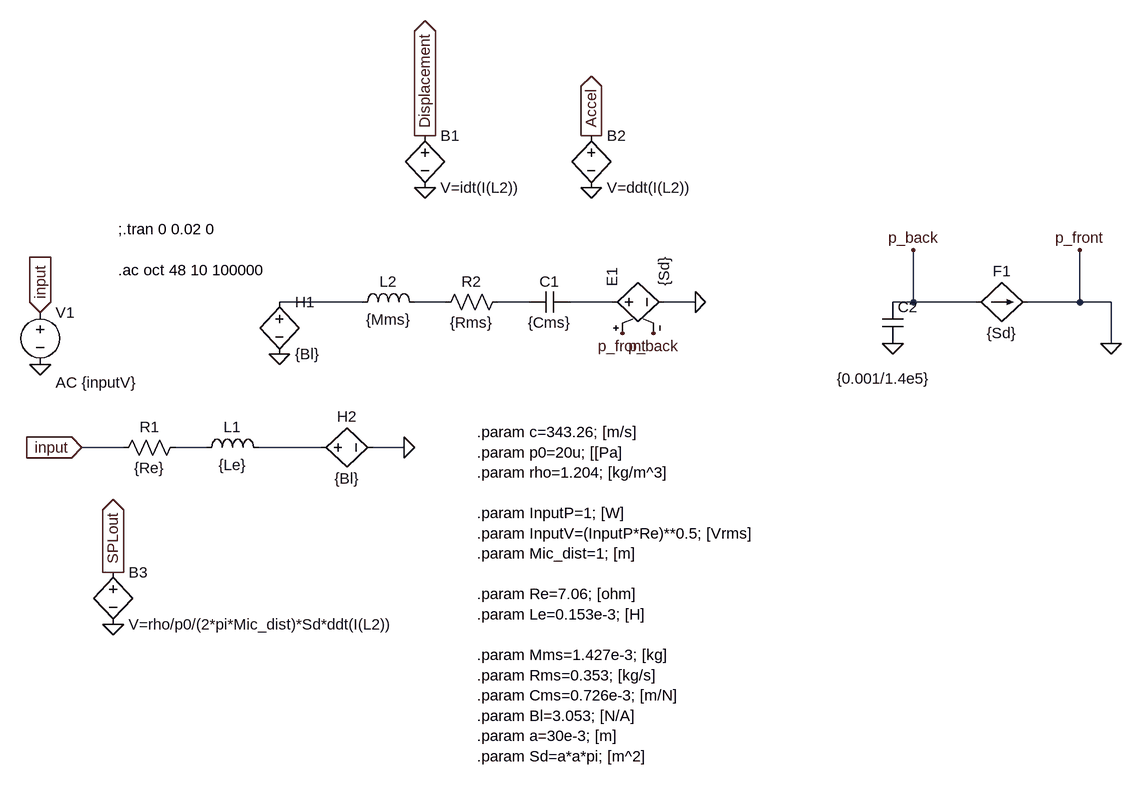
[diagram p0: schematic demo_05.asc]
demo_05.asc, the LTspice schematic file:
Version 4
SHEET 1 1700 776
WIRE 528 112 400 112
WIRE 656 112 608 112
WIRE 784 112 736 112
WIRE 912 112 848 112
WIRE 1040 112 992 112
WIRE 1376 112 1376 32
WIRE 1376 112 1344 112
WIRE 1472 112 1376 112
WIRE 1632 112 1632 32
WIRE 1632 112 1552 112
WIRE 1680 112 1632 112
WIRE 1680 176 1680 112
WIRE 160 336 96 336
WIRE 288 336 240 336
WIRE 464 336 368 336
WIRE 592 336 544 336
FLAG 32 208 0
FLAG 32 128 input
IOPIN 32 128 In
FLAG 592 336 0
FLAG 96 336 input
IOPIN 96 336 In
FLAG 1040 112 0
FLAG 624 -64 0
FLAG 880 -64 0
FLAG 624 -144 Displacement
IOPIN 624 -144 Out
FLAG 880 -144 Accel
IOPIN 880 -144 Out
FLAG 400 192 0
FLAG 144 608 0
FLAG 144 528 SPLout
IOPIN 144 528 Out
FLAG 1344 176 0
FLAG 1680 176 0
FLAG 1376 32 p_back
FLAG 1632 32 p_front
FLAG 976 160 p_back
FLAG 928 160 p_front
SYMBOL voltage 32 112 R0
WINDOW 123 24 124 Left 2
WINDOW 39 0 0 Left 0
SYMATTR Value2 AC {inputV}
SYMATTR InstName V1
SYMATTR Value ""
SYMBOL res 144 352 R270
WINDOW 0 32 56 VTop 2
WINDOW 3 0 56 VBottom 2
SYMATTR InstName R1
SYMATTR Value {Re}
SYMBOL ind 272 352 R270
WINDOW 0 32 56 VTop 2
WINDOW 3 5 56 VBottom 2
SYMATTR InstName L1
SYMATTR Value {Le}
SYMBOL ind 512 128 R270
WINDOW 0 32 56 VTop 2
WINDOW 3 5 56 VBottom 2
SYMATTR InstName L2
SYMATTR Value {Mms}
SYMBOL res 640 128 R270
WINDOW 0 32 56 VTop 2
WINDOW 3 0 56 VBottom 2
SYMATTR InstName R2
SYMATTR Value {Rms}
SYMBOL cap 784 128 R270
WINDOW 0 32 32 VTop 2
WINDOW 3 0 32 VBottom 2
SYMATTR InstName C1
SYMATTR Value {Cms}
SYMBOL bv 624 -160 R0
SYMATTR InstName B1
SYMATTR Value V=idt(I(L2))
SYMBOL bv 880 -160 R0
SYMATTR InstName B2
SYMATTR Value V=ddt(I(L2))
SYMBOL h 400 96 R0
SYMATTR InstName H1
SYMATTR Value {Bl}
SYMATTR SpiceModel L1
SYMBOL h 448 336 R270
WINDOW 0 32 56 VTop 2
WINDOW 3 -32 56 VBottom 2
SYMATTR InstName H2
SYMATTR Value {Bl}
SYMATTR SpiceModel L2
SYMBOL bv 144 512 R0
SYMATTR InstName B3
SYMATTR Value V=rho/p0/(2*pi*Mic_dist)*Sd*ddt(I(L2))
SYMBOL f 1472 112 R270
WINDOW 0 32 40 VTop 2
WINDOW 3 -32 40 VBottom 2
SYMATTR InstName F1
SYMATTR Value {Sd}
SYMATTR SpiceModel L2
SYMBOL cap 1328 112 R0
WINDOW 3 -70 118 Left 2
SYMATTR InstName C2
SYMATTR Value {0.001/1.4e5}
SYMATTR SpiceLine Rpar=1e999
SYMBOL e 896 112 R270
SYMATTR InstName E1
SYMATTR Value {Sd}
TEXT 152 0 Left 2 !;.tran 0 0.02 0\n\n.ac oct 48 10 100000
TEXT 704 312 Left 2 !.param c=343.26; [m/s]\n.param p0=20u; [[Pa]\n.param rho=1.204; [kg/m^3]\n \n.param InputP=1; [W] \n.param InputV=(InputP*Re)**0.5; [Vrms]\n.param Mic_dist=1; [m]\n \n.param Re=7.06; [ohm]\n.param Le=0.153e-3; [H]\n \n.param Mms=1.427e-3; [kg]\n.param Rms=0.353; [kg/s]\n.param Cms=0.726e-3; [m/N]\n.param Bl=3.053; [N/A]\n.param a=30e-3; [m]\n.param Sd=a*a*pi; [m^2]

The netlist it stands for:
* demo_05.asc
V1 input 0 AC {inputV}
R1 input N005 {Re}
L1 N005 N006 {Le}
L2 N001 N002 {Mms}
R2 N002 N003 {Rms}
C1 N003 N004 {Cms}
B1 Displacement 0 V=idt(I(L2))
B2 Accel 0 V=ddt(I(L2))
H1 N001 0 L1 {Bl}
H2 N006 0 L2 {Bl}
B3 SPLout 0 V=rho/p0/(2*pi*Mic_dist)*Sd*ddt(I(L2))
F1 p_back 0 L2 {Sd}
C2 p_back 0 {0.001/1.4e5} Rpar=1e999
E1 N004 0 0 p_back {Sd}
;.tran 0 0.02 0
.ac oct 48 10 100000
.param c=343.26; [m/s]
.param p0=20u; [[Pa]
.param rho=1.204; [kg/m^3]
.param InputP=1; [W]
.param InputV=(InputP*Re)**0.5; [Vrms]
.param Mic_dist=1; [m]
.param Re=7.06; [ohm]
.param Le=0.153e-3; [H]
.param Mms=1.427e-3; [kg]
.param Rms=0.353; [kg/s]
.param Cms=0.726e-3; [m/N]
.param Bl=3.053; [N/A]
.param a=30e-3; [m]
.param Sd=a*a*pi; [m^2]
.backanno
.end

* Results of the author's LTspice run, read from the files saved beside the schematic
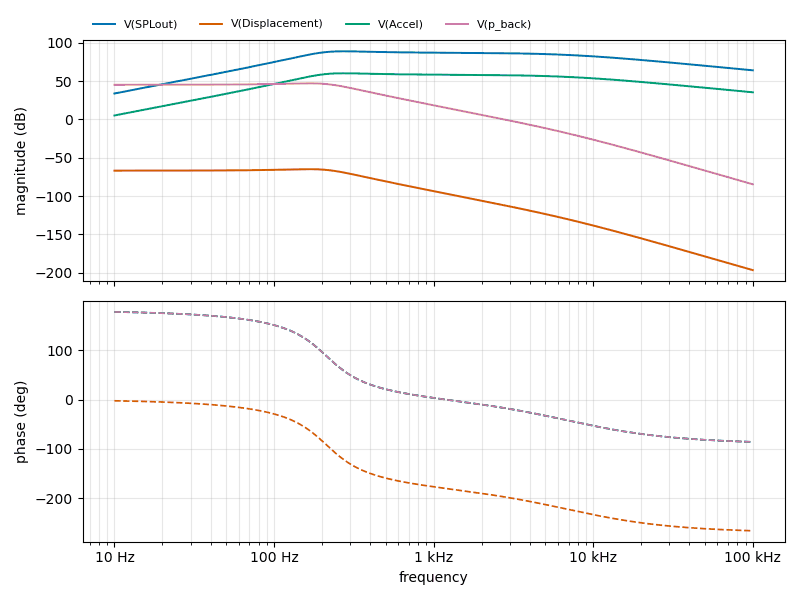
[diagram p1: AC Analysis of demo_05.asc, plotted from the saved traces]
* AC Analysis, 1 run:
*   V(SPLout): 33.85 dB at 10 Hz, 64.07 dB at 100 kHz, peak 88.88 dB at 273 Hz, 3 dB below the peak at 179.7 Hz and 3.861 kHz
*   V(Displacement): -66.73 dB at 10 Hz, -196.51 dB at 100 kHz, peak -64.81 dB at 164.7 Hz, 3 dB below the peak at 251.6 Hz
*   V(Accel): 5.20 dB at 10 Hz, 35.41 dB at 100 kHz, peak 60.22 dB at 273 Hz, 3 dB below the peak at 179.7 Hz and 3.861 kHz
*   V(p_back): 45.22 dB at 10 Hz, -84.56 dB at 100 kHz, peak 47.14 dB at 164.7 Hz, 3 dB below the peak at 251.6 Hz